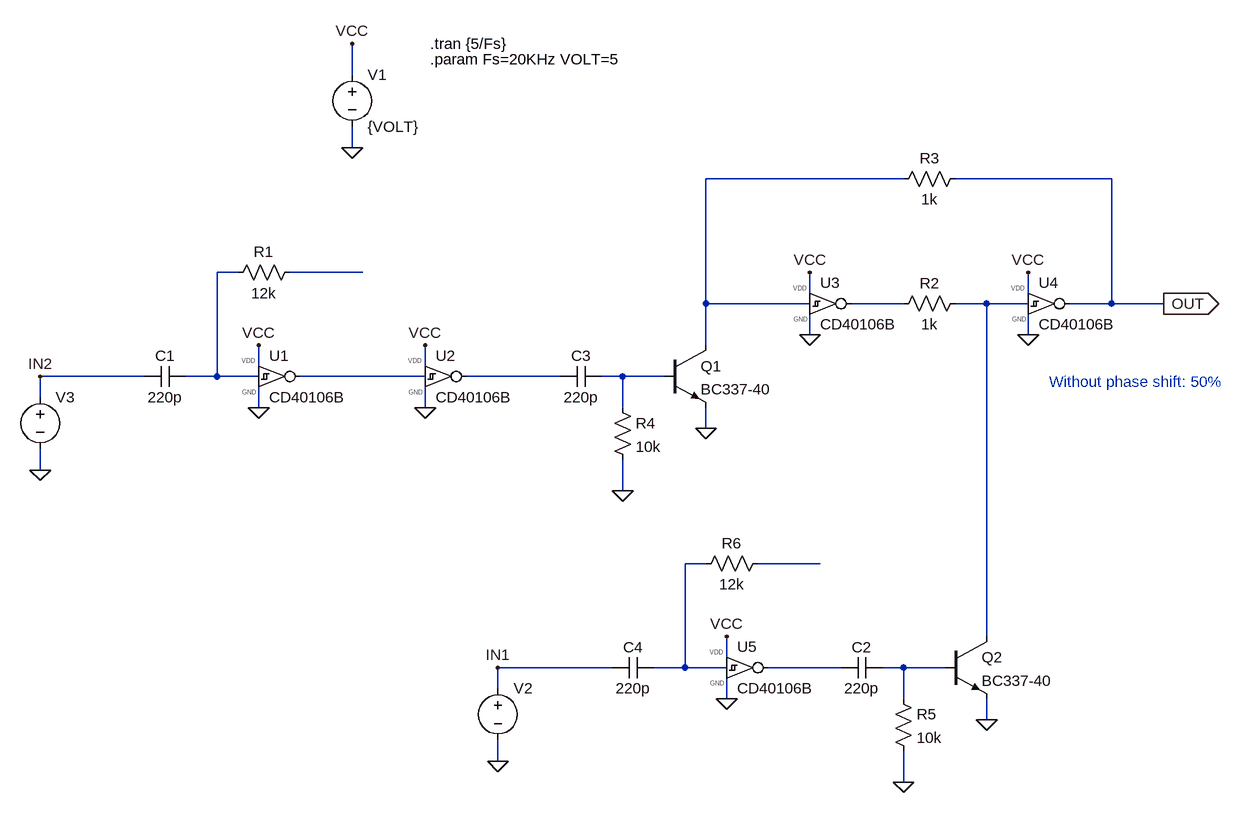
[diagram p0: schematic v1.1.asc]
v1.1.asc, the LTspice schematic file:
Version 4.1
SHEET 1 1776 1108
WIRE 224 -112 224 -160
WIRE 224 0 224 -32
WIRE 1072 48 768 48
WIRE 1392 48 1152 48
WIRE 48 192 16 192
WIRE 240 192 128 192
WIRE 928 224 928 192
WIRE 1264 224 1264 192
WIRE 768 240 768 48
WIRE 928 240 768 240
WIRE 1072 240 992 240
WIRE 1200 240 1152 240
WIRE 1264 240 1200 240
WIRE 1392 240 1392 48
WIRE 1392 240 1328 240
WIRE 1472 240 1392 240
WIRE 928 288 928 256
WIRE 1264 288 1264 256
WIRE 768 304 768 240
WIRE 80 336 80 304
WIRE 336 336 336 304
WIRE -96 352 -256 352
WIRE 16 352 16 192
WIRE 16 352 -32 352
WIRE 80 352 16 352
WIRE 336 352 144 352
WIRE 544 352 400 352
WIRE 640 352 608 352
WIRE 704 352 640 352
WIRE -256 384 -256 352
WIRE 80 400 80 368
WIRE 336 400 336 368
WIRE 640 400 640 352
WIRE 768 432 768 400
WIRE -256 496 -256 464
WIRE 640 528 640 480
WIRE 768 640 736 640
WIRE 944 640 848 640
WIRE 1200 752 1200 240
WIRE 800 784 800 752
WIRE 624 800 448 800
WIRE 736 800 736 640
WIRE 736 800 688 800
WIRE 800 800 736 800
WIRE 976 800 864 800
WIRE 1072 800 1040 800
WIRE 1136 800 1072 800
WIRE 448 832 448 800
WIRE 800 848 800 816
WIRE 1072 848 1072 800
WIRE 1200 880 1200 848
WIRE 448 944 448 912
WIRE 1072 976 1072 928
FLAG 224 0 0
FLAG 224 -160 VCC
FLAG 80 400 0
FLAG 80 304 VCC
FLAG -256 496 0
FLAG -256 352 IN2
FLAG 1472 240 OUT
IOPIN 1472 240 Out
FLAG 768 432 0
FLAG 928 288 0
FLAG 928 192 VCC
FLAG 1264 288 0
FLAG 1264 192 VCC
FLAG 1072 976 0
FLAG 1200 880 0
FLAG 448 944 0
FLAG 448 800 IN1
FLAG 640 528 0
FLAG 800 848 0
FLAG 800 752 VCC
FLAG 336 400 0
FLAG 336 304 VCC
SYMBOL voltage 224 -128 R0
WINDOW 123 0 0 Left 0
WINDOW 39 0 0 Left 0
SYMATTR InstName V1
SYMATTR Value {VOLT}
SYMBOL voltage -256 368 R0
WINDOW 3 41 64 Invisible 2
WINDOW 123 0 0 Left 0
WINDOW 39 0 0 Left 0
SYMATTR Value PULSE(0 {VOLT} {0.25/Fs} 1n 1n {0.5/Fs} {1/Fs})
SYMATTR InstName V3
SYMBOL cap -96 368 R270
WINDOW 0 32 32 VTop 2
WINDOW 3 0 32 VBottom 2
SYMATTR InstName C1
SYMATTR Value 220p
SYMBOL res 144 176 R90
WINDOW 0 0 56 VBottom 2
WINDOW 3 32 56 VTop 2
SYMATTR InstName R1
SYMATTR Value 12k
SYMBOL npn 704 304 R0
SYMATTR InstName Q1
SYMATTR Value BC337-40
SYMBOL res 1056 256 R270
WINDOW 0 32 56 VTop 2
WINDOW 3 0 56 VBottom 2
SYMATTR InstName R2
SYMATTR Value 1k
SYMBOL res 1168 32 R90
WINDOW 0 0 56 VBottom 2
WINDOW 3 32 56 VTop 2
SYMATTR InstName R3
SYMATTR Value 1k
SYMBOL cap 976 816 R270
WINDOW 0 32 32 VTop 2
WINDOW 3 0 32 VBottom 2
SYMATTR InstName C2
SYMATTR Value 220p
SYMBOL res 1056 832 R0
SYMATTR InstName R5
SYMATTR Value 10k
SYMBOL npn 1136 752 R0
SYMATTR InstName Q2
SYMATTR Value BC337-40
SYMBOL voltage 448 816 R0
WINDOW 3 41 64 Invisible 2
WINDOW 123 0 0 Left 0
WINDOW 39 0 0 Left 0
SYMATTR Value PULSE(0 {VOLT} 0 1n 1n {0.5/Fs} {1/Fs})
SYMATTR InstName V2
SYMBOL cap 544 368 R270
WINDOW 0 32 32 VTop 2
WINDOW 3 0 32 VBottom 2
SYMATTR InstName C3
SYMATTR Value 220p
SYMBOL res 624 384 R0
SYMATTR InstName R4
SYMATTR Value 10k
SYMBOL cap 624 816 R270
WINDOW 0 32 32 VTop 2
WINDOW 3 0 32 VBottom 2
SYMATTR InstName C4
SYMATTR Value 220p
SYMBOL res 864 624 R90
WINDOW 0 0 56 VBottom 2
WINDOW 3 32 56 VTop 2
SYMATTR InstName R6
SYMATTR Value 12k
SYMBOL MyLib\\Digital\\CD40106B 80 320 R0
SYMATTR InstName U1
SYMBOL MyLib\\Digital\\CD40106B 336 320 R0
SYMATTR InstName U2
SYMBOL MyLib\\Digital\\CD40106B 928 208 R0
SYMATTR InstName U3
SYMBOL MyLib\\Digital\\CD40106B 1264 208 R0
SYMATTR InstName U4
SYMBOL MyLib\\Digital\\CD40106B 800 768 R0
SYMATTR InstName U5
TEXT 344 -136 Left 2 !.param Fs=20KHz VOLT=5
TEXT 344 -160 Left 2 !.tran {5/Fs}
TEXT 1296 360 Left 2 ;Without phase shift: 50%

The netlist it stands for:
* v1.1.asc
V1 VCC 0 {VOLT}
V3 IN2 0 PULSE(0 {VOLT} {0.25/Fs} 1n 1n {0.5/Fs} {1/Fs})
C1 IN2 N002 220p
R1 N003 N002 12k
Q1 N001 N008 0 0 BC337-40
R2 N004 N005 1k
R3 OUT N001 1k
C2 N011 N012 220p
R5 N012 0 10k
Q2 N005 N012 0 0 BC337-40
V2 IN1 0 PULSE(0 {VOLT} 0 1n 1n {0.5/Fs} {1/Fs})
C3 N007 N008 220p
R4 N008 0 10k
C4 IN1 N009 220p
R6 N010 N009 12k
X§U1 N002 N006 VCC 0 CD40106B vdd=5 speed=2 tripdt=100n  ; pins in out VDD GND
X§U2 N006 N007 VCC 0 CD40106B vdd=5 speed=2 tripdt=100n  ; pins in out VDD GND
X§U3 N001 N004 VCC 0 CD40106B vdd=5 speed=2 tripdt=100n  ; pins in out VDD GND
X§U4 N005 OUT VCC 0 CD40106B vdd=5 speed=2 tripdt=100n  ; pins in out VDD GND
X§U5 N009 N011 VCC 0 CD40106B vdd=5 speed=2 tripdt=100n  ; pins in out VDD GND
.model NPN NPN
.model PNP PNP
.lib standard.bjt
.param Fs=20KHz VOLT=5
.tran {5/Fs}
* Without phase shift: 50%
.lib MyLib/Digital/_CD4xxx.lib
.backanno
.end